# EAGLE schematic version0.1 (EAGLE 7.3.0)
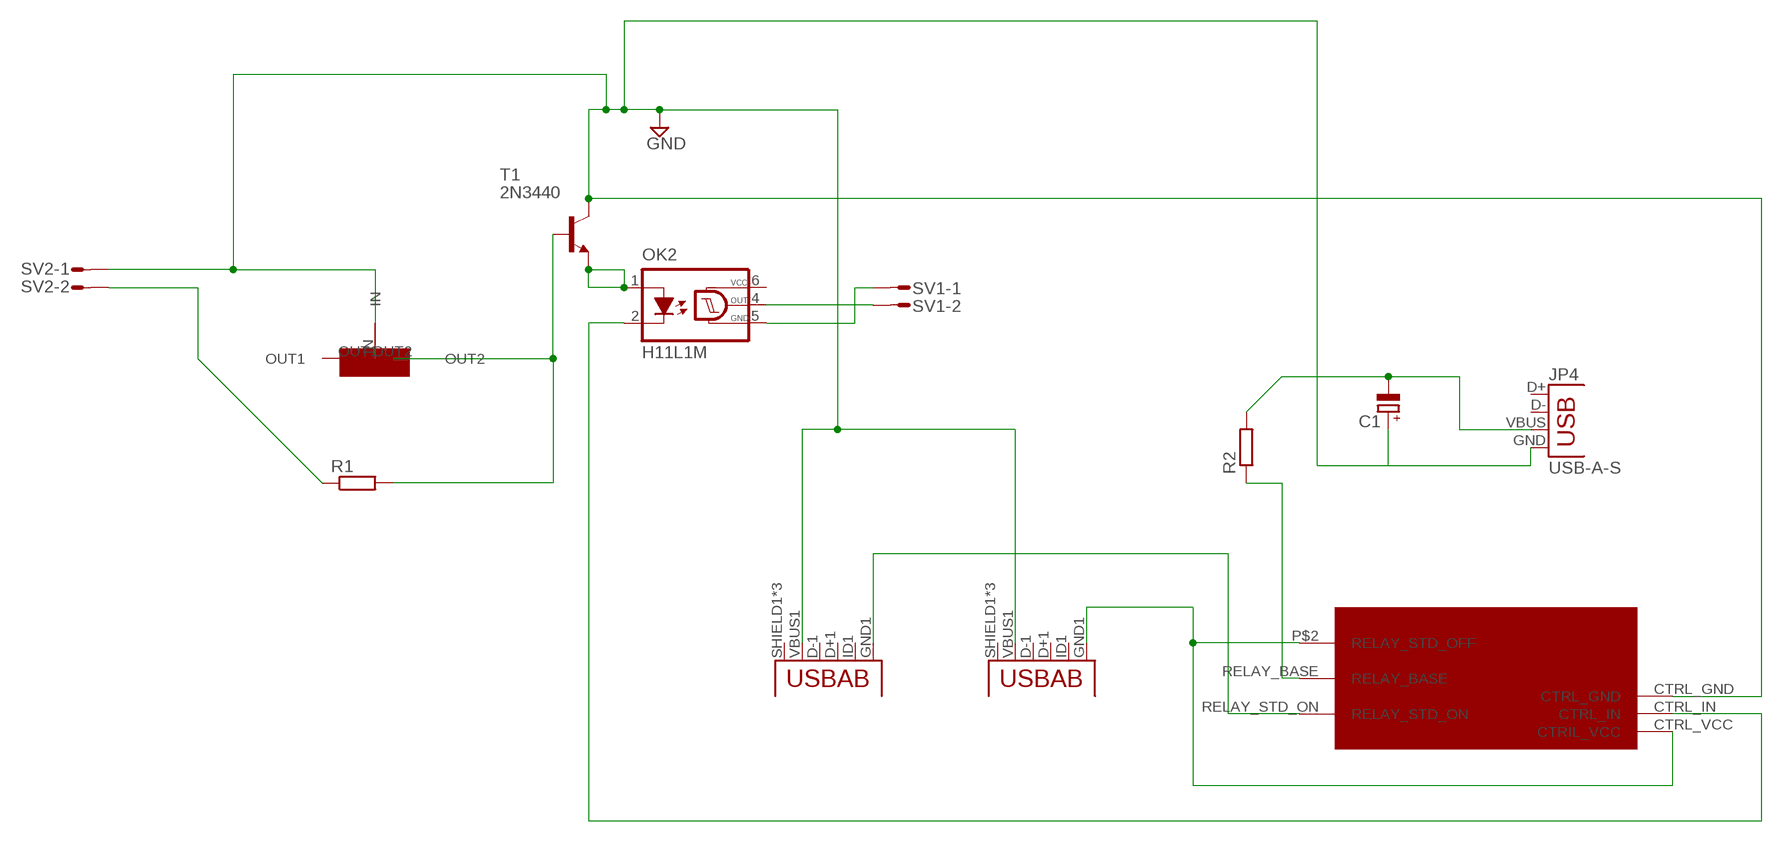
[diagram p0: schematic, sheet 1]

## Parts
C1  CPOL-EU150CLZ-1014  [150CLZ-1014]
JP2  USB-ABCONN-11794  [USB-AB-MICRO-SMD_V03]
JP3  USB-ABCONN-11794  [USB-AB-MICRO-SMD_V03]
JP4  USB-A-S  [USB-A-S]
OK2  H11L1M  [DIL06]
R1  R-EU_VMTB60  [VMTB60]
R2  R-EU_VMTB60  [VMTB60]
SV1  L02P  [L02P]
SV2  L02P  [L02P]
T1  2N3440  [TO5]
U$1  RELAY_BOARD  [RELAY_BOARD]
U$5  POT_TRIMMER  [POT_TRIMMER]

## Nets
GND: C1.+ JP2.VBUS1(VBUS) JP3.VBUS1(VBUS) JP4.GND SV2.1 T1.3(C) U$1.CTRL_GND U$5.IN
N$1: R1.2 T1.2(B) U$5.OUT2
N$2: C1.- JP4.VBUS R2.2
N$3: OK2.2(C) U$1.CTRL_IN
N$4: JP2.GND1(GND) U$1.CTRL_VCC(CTRIL_VCC) U$1.P$2(RELAY_STD_OFF)
N$5: R1.1 SV2.2
N$6: JP3.GND1(GND) U$1.RELAY_STD_ON
N$7: OK2.5(GND) SV1.1
N$8: OK2.1(A) T1.1(E)
N$9: OK2.4(OUT) SV1.2
N$10: R2.1 U$1.RELAY_BASE
Unconnected: JP2.D+1(D+) JP2.D-1(D-) JP2.ID1(USBID) JP2.SHIELD1(SHIELD) JP2.SHIELD2(SHIELD) JP2.SHIELD3(SHIELD) JP3.D+1(D+) JP3.D-1(D-) JP3.ID1(USBID) JP3.SHIELD1(SHIELD) JP3.SHIELD2(SHIELD) JP3.SHIELD3(SHIELD) JP4.D+ JP4.D- U$5.OUT1

## Power pins joined to a net without a drawn wire
VCC: OK2.6(VCC)

## Library data of the parts
C1 = rcl:CPOL-EU: POLARIZED CAPACITOR, European symbol
JP2 JP3 = SparkFun-Connectors:USB-AB: This is a USB AB connector that is compatible with USB OTG. i.e. this connector can serve as a host or device; PROD_ID: CONN-11794
JP4 = SparkFun-Connectors:USB: USB Connectors USB-B-PTH is fully proven SKU : PRT-00139/CONN-08278 USB-miniB is fully proven SKU : PRT-00587 USB-A-PCB is untested. USB-A-H is throughly reviewed, but untested. Spark Fun Electronics SKU : PRT-00437 USB-B-SMT is throughly reviewed, but untested. Needs silkscreen touching up. USB-A-S has not been used/tested USB-MB-H has not been used/tested USB-MICROB has been used. CONN-09505
OK2 = optocoupler:H11L*M: 6-Pin DIP Optocoupler Source: http://www.fairchildsemi.com/ds/H1/H11L2-M.pdf; MF: FAIRCHILD SEMICONDUCTOR; MPN: H11L1-M; OC_FARNELL: 1021127; OC_NEWARK: 72K8643
R1 R2 = resistor:R-EU_: RESISTOR, European symbol
SV1 SV2 = con-amp-mt:L02P: AMP MT CONNECTOR; OC_FARNELL: unknown; OC_NEWARK: unknown
T1 = transistor:2N3440: NPN TRANSISTOR
U$1 = MBLIB:RELAY_BOARD
U$5 = MBLIB:POT_TRIMMER